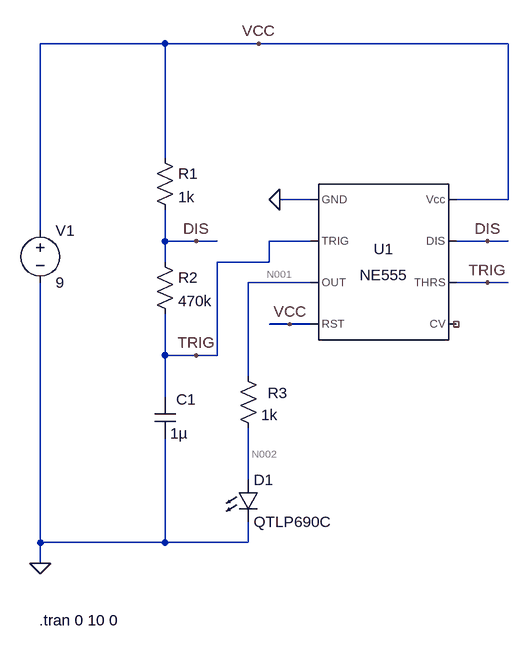
[diagram p0: schematic GTB5_Sim.asc]
GTB5_Sim.asc, the LTspice schematic file:
Version 4
SHEET 1 880 1064
WIRE -80 -128 -272 -128
WIRE 64 -128 -80 -128
WIRE 448 -128 64 -128
WIRE -80 48 -80 -128
WIRE 144 112 96 112
WIRE 448 112 448 -128
WIRE 448 112 368 112
WIRE -272 160 -272 -128
WIRE -80 176 -80 128
WIRE -32 176 -80 176
WIRE 0 176 -32 176
WIRE 144 176 80 176
WIRE 416 176 368 176
WIRE 448 176 416 176
WIRE -80 208 -80 176
WIRE 80 208 80 176
WIRE 80 208 0 208
WIRE 144 240 48 240
WIRE 416 240 368 240
WIRE 448 240 416 240
WIRE 112 304 80 304
WIRE 144 304 112 304
WIRE -80 352 -80 288
WIRE -32 352 -80 352
WIRE 0 352 0 208
WIRE 0 352 -32 352
WIRE 48 384 48 240
WIRE -80 416 -80 352
WIRE 48 544 48 464
WIRE -272 640 -272 240
WIRE -80 640 -80 480
WIRE -80 640 -272 640
WIRE 48 640 48 608
WIRE 48 640 -80 640
WIRE -272 672 -272 640
FLAG 96 112 0
FLAG -32 176 DIS
FLAG 64 -128 VCC
FLAG -32 352 TRIG
FLAG 112 304 VCC
FLAG 416 240 TRIG
FLAG -272 672 0
FLAG 416 176 DIS
SYMBOL Misc\\NE555 256 208 R0
SYMATTR InstName U1
SYMBOL res -96 32 R0
SYMATTR InstName R1
SYMATTR Value 1k
SYMBOL res -96 192 R0
SYMATTR InstName R2
SYMATTR Value 470k
SYMBOL cap -96 416 R0
WINDOW 0 33 4 Left 2
SYMATTR InstName C1
SYMATTR Value 1µ
SYMBOL res 32 368 R0
WINDOW 0 46 42 Left 2
SYMATTR InstName R3
SYMATTR Value 1k
SYMBOL voltage -272 144 R0
WINDOW 123 0 0 Left 0
WINDOW 39 0 0 Left 0
SYMATTR InstName V1
SYMATTR Value 9
SYMBOL LED 32 544 R0
SYMATTR InstName D1
SYMATTR Value QTLP690C
TEXT -274 760 Left 2 !.tran 0 10 0

The netlist it stands for:
* GTB5_Sim.asc
XU1 0 TRIG N001 VCC NC_01 TRIG DIS VCC NE555  ; pins GND TRIG OUT RST CV THRS DIS Vcc
R1 VCC DIS 1k
R2 DIS TRIG 470k
C1 TRIG 0 1µ
R3 N001 N002 1k
V1 VCC 0 9
D1 N002 0 QTLP690C
.model D D
.lib standard.dio
.tran 0 10 0
.lib NE555.sub
.backanno
.end

* Results of the author's LTspice run, read from the files saved beside the schematic
* Operating Point, zero values left out:
*   V(trig) = 8.992 V
*   V(vcc) = 9 V
*   V(dis) = 9 V
*   V(n001) = 8.957 V
*   V(n002) = 1.816 V
*   I(D1) = 7.141 mA
*   I(R3) = 7.141 mA
*   I(R2) = 17.98 nA
*   I(R1) = 29.99 nA
*   I(V1) = -10.05 mA
*   Ix(u1:1) = -2.908 mA
*   Ix(u1:2) = 8.992 nA
*   Ix(u1:3) = -7.141 mA
*   Ix(u1:4) = 49.33 µA
*   Ix(u1:6) = 8.992 nA
*   Ix(u1:7) = 12.01 nA
*   Ix(u1:8) = 10 mA
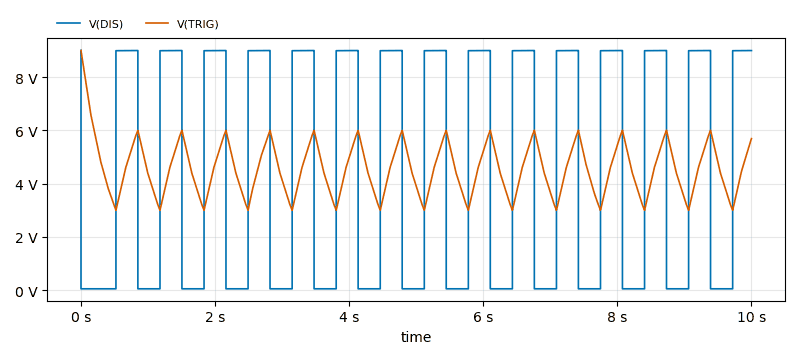
[diagram p1: Transient Analysis of GTB5_Sim.asc, plotted from the saved traces]
* Transient Analysis, 1 run:
*   V(DIS): min 53.72 mV, max 9 V, average 4.397 V, rms 6.267 V, last 8.993 V
*   V(TRIG): min 2.999 V, max 8.992 V, average 4.549 V, rms 4.683 V, last 5.69 V